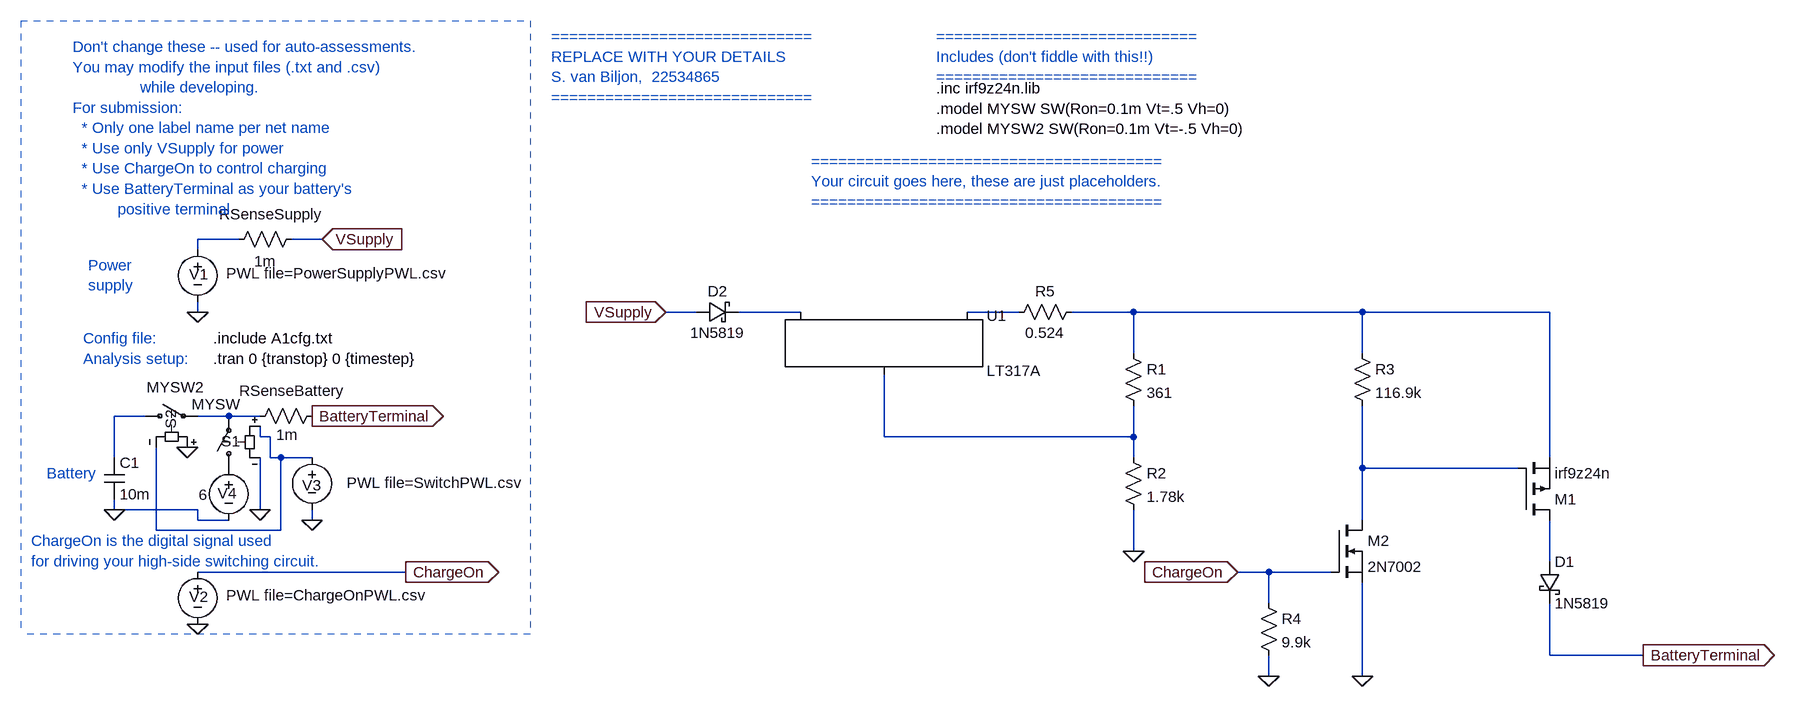
[diagram p0: schematic E344_22534865_A2.asc]
E344_22534865_A2.asc, the LTspice schematic file:
Version 4
SHEET 1 1824 680
WIRE -2032 -1088 -2096 -1088
WIRE -1904 -1088 -1952 -1088
WIRE -2096 -1072 -2096 -1088
WIRE -2096 -976 -2096 -992
WIRE -1328 -976 -1376 -976
WIRE -1168 -976 -1264 -976
WIRE -832 -976 -912 -976
WIRE -656 -976 -752 -976
WIRE -304 -976 -656 -976
WIRE -16 -976 -304 -976
WIRE -656 -912 -656 -976
WIRE -304 -912 -304 -976
WIRE -2176 -816 -2224 -816
WIRE -2048 -816 -2096 -816
WIRE -2000 -816 -2048 -816
WIRE -2000 -784 -2000 -800
WIRE -1984 -784 -2000 -784
WIRE -1040 -784 -1040 -880
WIRE -656 -784 -656 -832
WIRE -656 -784 -1040 -784
WIRE -2224 -752 -2224 -816
WIRE -1984 -752 -1984 -784
WIRE -1968 -752 -1984 -752
WIRE -1920 -752 -1968 -752
WIRE -656 -752 -656 -784
WIRE -16 -752 -16 -976
WIRE -304 -736 -304 -832
WIRE -64 -736 -304 -736
WIRE -2224 -672 -2224 -688
WIRE -2096 -672 -2224 -672
WIRE -2000 -672 -2000 -752
WIRE -2096 -656 -2096 -672
WIRE -2048 -656 -2096 -656
WIRE -1920 -656 -1920 -672
WIRE -304 -656 -304 -736
WIRE -2160 -640 -2160 -768
WIRE -1968 -640 -1968 -752
WIRE -1968 -640 -2160 -640
WIRE -656 -608 -656 -672
WIRE -16 -592 -16 -656
WIRE -1776 -576 -2096 -576
WIRE -448 -576 -496 -576
WIRE -352 -576 -448 -576
WIRE -448 -528 -448 -576
WIRE -16 -448 -16 -528
WIRE 128 -448 -16 -448
WIRE -448 -416 -448 -448
WIRE -304 -416 -304 -560
FLAG -2096 -976 0
FLAG -1904 -1088 VSupply
IOPIN -1904 -1088 In
FLAG -1920 -816 BatteryTerminal
IOPIN -1920 -816 Out
FLAG -1776 -576 ChargeOn
IOPIN -1776 -576 Out
FLAG -2096 -496 0
FLAG -1376 -976 VSupply
IOPIN -1376 -976 In
FLAG 128 -448 BatteryTerminal
IOPIN 128 -448 Out
FLAG -496 -576 ChargeOn
IOPIN -496 -576 In
FLAG -2000 -672 0
FLAG -1920 -656 0
FLAG -2112 -768 0
FLAG -2224 -672 0
FLAG -656 -608 0
FLAG -448 -416 0
FLAG -304 -416 0
SYMBOL voltage -2096 -1088 R0
WINDOW 123 0 0 Left 0
WINDOW 39 0 0 Left 0
WINDOW 3 44 52 Left 2
WINDOW 0 -13 54 Left 2
SYMATTR Value PWL file=PowerSupplyPWL.csv
SYMATTR InstName V1
SYMBOL res -1904 -832 R90
WINDOW 0 -7 47 VBottom 2
WINDOW 3 29 54 VTop 2
SYMATTR InstName RSenseBattery
SYMATTR Value 1m
SYMBOL res -1936 -1104 R90
WINDOW 0 -7 47 VBottom 2
WINDOW 3 34 56 VTop 2
SYMATTR InstName RSenseSupply
SYMATTR Value 1m
SYMBOL cap -2240 -752 R0
SYMATTR InstName C1
SYMATTR Value 10m
SYMATTR SpiceLine2 IC=6
SYMBOL voltage -2096 -592 R0
WINDOW 123 0 0 Left 0
WINDOW 39 0 0 Left 0
WINDOW 3 44 52 Left 2
WINDOW 0 -13 54 Left 2
SYMATTR Value PWL file=ChargeOnPWL.csv
SYMATTR InstName V2
SYMBOL PowerProducts\\LT317A -1040 -976 R0
SYMATTR InstName U1
SYMBOL pmos -64 -656 M180
SYMATTR InstName M1
SYMATTR Value irf9z24n
SYMATTR Prefix X
SYMATTR SpiceModel irf9z24n
SYMBOL nmos -352 -656 R0
SYMATTR InstName M2
SYMATTR Value 2N7002
SYMBOL schottky -32 -592 R0
SYMATTR InstName D1
SYMATTR Value 1N5819
SYMATTR Description Diode
SYMATTR Type diode
SYMBOL schottky -1328 -960 R270
WINDOW 0 32 32 VTop 2
WINDOW 3 0 32 VBottom 2
SYMATTR InstName D2
SYMATTR Value 1N5819
SYMATTR Description Diode
SYMATTR Type diode
SYMBOL sw -2048 -720 R180
WINDOW 0 -18 57 Left 2
WINDOW 3 -17 114 Left 2
SYMATTR InstName S1
SYMATTR Value MYSW
SYMBOL voltage -1920 -768 R0
WINDOW 0 0 43 Top 2
WINDOW 3 188 70 Bottom 2
WINDOW 123 0 0 Left 0
WINDOW 39 0 0 Left 0
SYMATTR InstName V3
SYMATTR Value PWL file=SwitchPWL.csv
SYMBOL sw -2192 -816 R270
WINDOW 0 -20 55 Left 2
WINDOW 3 44 18 VRight 2
SYMATTR InstName S2
SYMATTR Value MYSW2
SYMBOL voltage -2048 -752 R0
WINDOW 0 -17 55 Left 2
WINDOW 3 -46 57 Left 2
WINDOW 123 0 0 Left 0
WINDOW 39 0 0 Left 0
SYMATTR InstName V4
SYMATTR Value 6
SYMBOL res -672 -928 R0
SYMATTR InstName R1
SYMATTR Value 361
SYMBOL res -672 -768 R0
SYMATTR InstName R2
SYMATTR Value 1.78k
SYMBOL res -320 -928 R0
SYMATTR InstName R3
SYMATTR Value 116.9k
SYMBOL res -464 -544 R0
SYMATTR InstName R4
SYMATTR Value 9.9k
SYMBOL res -848 -960 R270
WINDOW 0 32 56 VTop 2
WINDOW 3 0 56 VBottom 2
SYMATTR InstName R5
SYMATTR Value 0.524
TEXT -2072 -904 Left 2 !.tran 0 {transtop} 0 {timestep}
TEXT -2072 -936 Left 2 !.include A1cfg.txt
TEXT -2288 -1384 Left 2 ;Don't change these -- used for auto-assessments.\nYou may modify the input files (.txt and .csv) \n               while developing.\nFor submission: \n  * Only one label name per net name\n  * Use only VSupply for power\n  * Use ChargeOn to control charging\n  * Use BatteryTerminal as your battery's \n          positive terminal
TEXT -2272 -936 Left 2 ;Config file:
TEXT -2272 -904 Left 2 ;Analysis setup:
TEXT -2328 -728 Left 2 ;Battery
TEXT -2264 -1048 Left 2 ;Power\nsupply
TEXT -1552 -1400 Left 2 ;=============================\nREPLACE WITH YOUR DETAILS\nS. van Biljon,  22534865\n=============================
TEXT -960 -1320 Left 2 !.inc irf9z24n.lib\n.model MYSW SW(Ron=0.1m Vt=.5 Vh=0)\n.model MYSW2 SW(Ron=0.1m Vt=-.5 Vh=0)
TEXT -2352 -624 Left 2 ;ChargeOn is the digital signal used \nfor driving your high-side switching circuit.
TEXT -960 -1400 Left 2 ;=============================\nIncludes (don't fiddle with this!!)\n=============================
TEXT -1152 -1208 Left 2 ;=======================================\nYour circuit goes here, these are just placeholders.\n=======================================
LINE Normal -1584 -1424 -1584 -480 2
LINE Normal -2368 -1424 -1584 -1424 2
LINE Normal -1584 -480 -2368 -480 2
LINE Normal -1584 -496 -1584 -496 2
LINE Normal -2368 -1424 -2368 -480 2

The netlist it stands for:
* E344_22534865_A2.asc
V1 N001 0 PWL file=PowerSupplyPWL.csv
RSenseBattery BatteryTerminal N006 1m
RSenseSupply VSupply N001 1m
C1 N005 0 10m IC=6
V2 ChargeOn 0 PWL file=ChargeOnPWL.csv
XU1 N008 N003 N002 LT317A
XM1 N010 N009 N004 irf9z24n irf9z24n  ; pins D G S
M2 N009 ChargeOn 0 0 2N7002
D1 N010 BatteryTerminal 1N5819
D2 VSupply N002 1N5819
S1 P001 N006 N007 0 MYSW
V3 N007 0 PWL file=SwitchPWL.csv
S2 N005 N006 0 N007 MYSW2
V4 P001 0 6
R1 N004 N008 361
R2 N008 0 1.78k
R3 N004 N009 116.9k
R4 ChargeOn 0 9.9k
R5 N003 N004 0.524
.model D D
.lib standard.dio
.model NMOS NMOS
.model PMOS PMOS
.lib standard.mos
.tran 0 {transtop} 0 {timestep}
.include A1cfg.txt
* Don't change these -- used for auto-assessments.
* You may modify the input files (.txt and .csv)
*                while developing.
* For submission:
*   * Only one label name per net name
*   * Use only VSupply for power
*   * Use ChargeOn to control charging
*   * Use BatteryTerminal as your battery's
*           positive terminal
* Config file:
* Analysis setup:
* Battery
* Power
* supply
* =============================
* REPLACE WITH YOUR DETAILS
* S. van Biljon,  22534865
* =============================
.inc irf9z24n.lib
.model MYSW SW(Ron=0.1m Vt=.5 Vh=0)
.model MYSW2 SW(Ron=0.1m Vt=-.5 Vh=0)
* ChargeOn is the digital signal used
* for driving your high-side switching circuit.
* =============================
* Includes (don't fiddle with this!!)
* =============================
* =======================================
* Your circuit goes here, these are just placeholders.
* =======================================
.lib LTC.lib
.backanno
.end